# Altium schematic sheet receiver 2.SchDoc
size A4; SheetNumber: 4; SheetTotal: 9
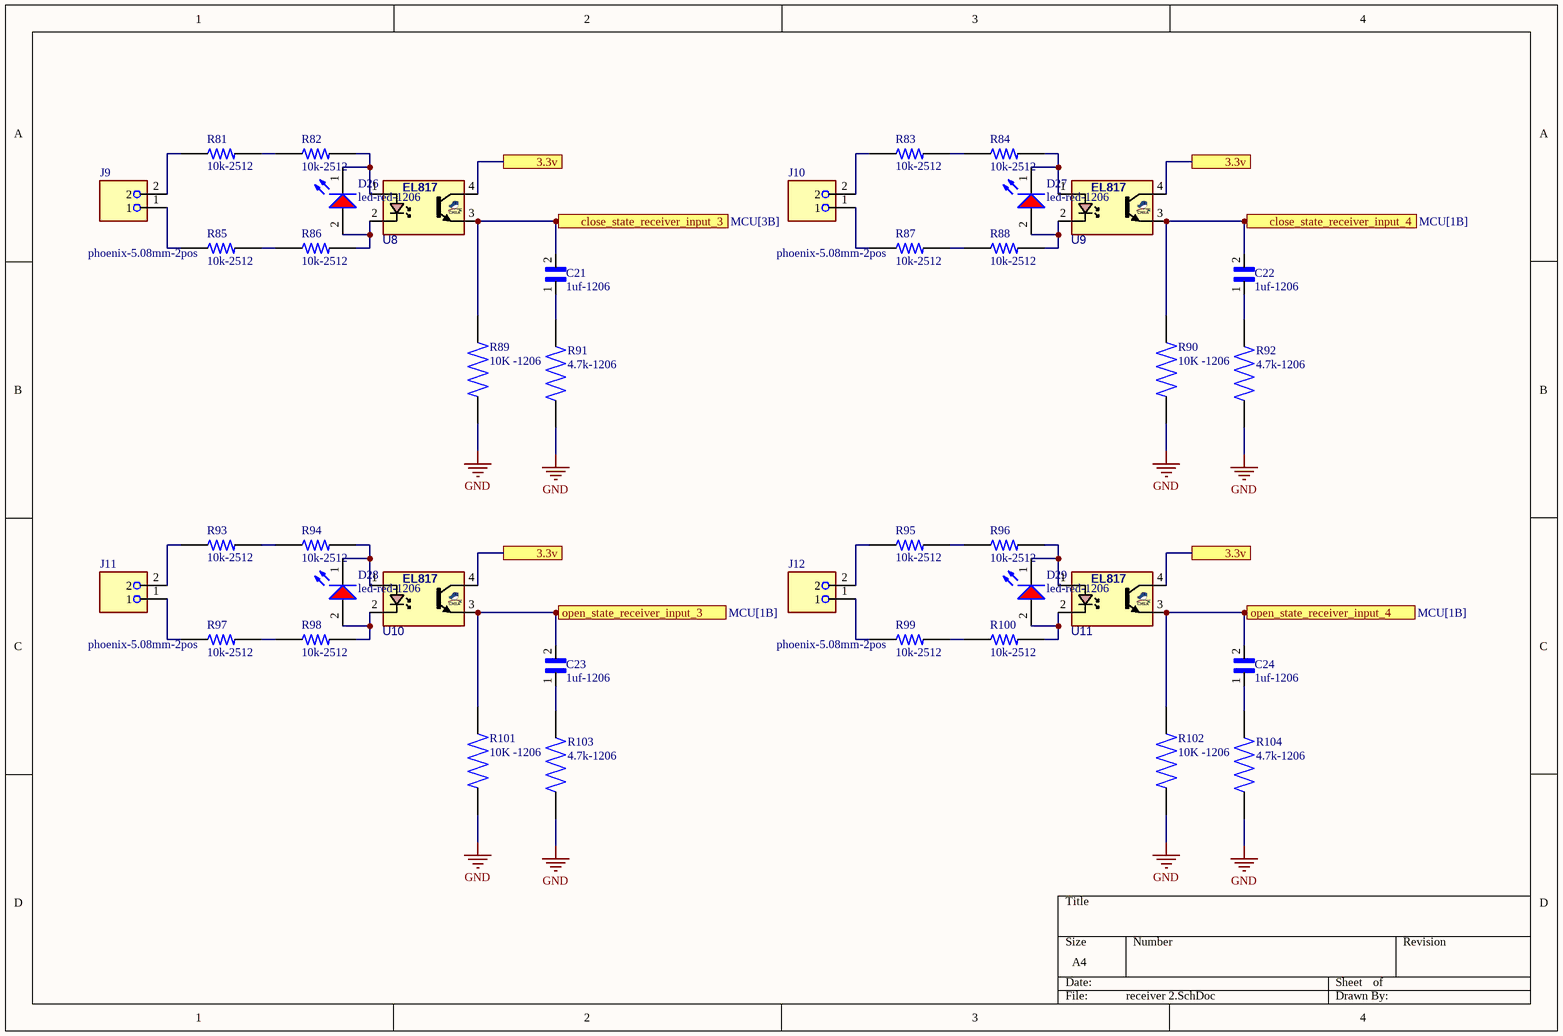
[diagram p0: receiver 2.SchDoc]

## Parts
C21  1uf-1206  [CAPC3216X180N]
C22  1uf-1206  [CAPC3216X180N]
C23  1uf-1206  [CAPC3216X180N]
C24  1uf-1206  [CAPC3216X180N]
D26  led-red-1206  [WL-SMRW_1206 dome_normal use]
D27  led-red-1206  [WL-SMRW_1206 dome_normal use]
D28  led-red-1206  [WL-SMRW_1206 dome_normal use]
D29  led-red-1206  [WL-SMRW_1206 dome_normal use]
J9  phoenix-5.08mm-2pos  [PHOENIX_1715721]
J10  phoenix-5.08mm-2pos  [PHOENIX_1715721]
J11  phoenix-5.08mm-2pos  [PHOENIX_1715721]
J12  phoenix-5.08mm-2pos  [PHOENIX_1715721]
R81  10k-2512  [RESC6331X70N]
R82  10k-2512  [RESC6331X70N]
R83  10k-2512  [RESC6331X70N]
R84  10k-2512  [RESC6331X70N]
R85  10k-2512  [RESC6331X70N]
R86  10k-2512  [RESC6331X70N]
R87  10k-2512  [RESC6331X70N]
R88  10k-2512  [RESC6331X70N]
R89  10K -1206  [RESC3015X65N]
R90  10K -1206  [RESC3015X65N]
R91  4.7k-1206  [RESC3015X65N]
R92  4.7k-1206  [RESC3015X65N]
R93  10k-2512  [RESC6331X70N]
R94  10k-2512  [RESC6331X70N]
R95  10k-2512  [RESC6331X70N]
R96  10k-2512  [RESC6331X70N]
R97  10k-2512  [RESC6331X70N]
R98  10k-2512  [RESC6331X70N]
R99  10k-2512  [RESC6331X70N]
R100  10k-2512  [RESC6331X70N]
R101  10K -1206  [RESC3015X65N]
R102  10K -1206  [RESC3015X65N]
R103  4.7k-1206  [RESC3015X65N]
R104  4.7k-1206  [RESC3015X65N]
U8  EL817  [DIP_4SMD]  (value not drawn)
U9  EL817  [DIP_4SMD]  (value not drawn)
U10  EL817  [DIP_4SMD]  (value not drawn)
U11  EL817  [DIP_4SMD]  (value not drawn)

## Ports
3.3v (see interface[1D], interface[2D], interface[3C], jack driver 1[2A], jack driver 1[3B], jack driver 2[2A], jack driver 2[3B], motor driver 1[2B], motor driver 1[3B], motor driver 2[2B], motor driver 2[3B], Power[2D], receiver 1[2A], receiver 1[2C], receiver 1[4A], receiver 1[4C], receiver 2[2A], receiver 2[2C], receiver 2[4A]), 3.3v (see interface[1D], interface[2D], interface[3C], jack driver 1[2A], jack driver 1[3B], jack driver 2[2A], jack driver 2[3B], motor driver 1[2B], motor driver 1[3B], motor driver 2[2B], motor driver 2[3B], Power[2D], receiver 1[2A], receiver 1[2C], receiver 1[4A], receiver 1[4C], receiver 2[2A], receiver 2[2C], receiver 2[4C]), 3.3v (see interface[1D], interface[2D], interface[3C], jack driver 1[2A], jack driver 1[3B], jack driver 2[2A], jack driver 2[3B], motor driver 1[2B], motor driver 1[3B], motor driver 2[2B], motor driver 2[3B], Power[2D], receiver 1[2A], receiver 1[2C], receiver 1[4A], receiver 1[4C], receiver 2[2A], receiver 2[4A], receiver 2[4C]), 3.3v (see interface[1D], interface[2D], interface[3C], jack driver 1[2A], jack driver 1[3B], jack driver 2[2A], jack driver 2[3B], motor driver 1[2B], motor driver 1[3B], motor driver 2[2B], motor driver 2[3B], Power[2D], receiver 1[2A], receiver 1[2C], receiver 1[4A], receiver 1[4C], receiver 2[2C], receiver 2[4A], receiver 2[4C]), close_state_receiver_input_3 (see MCU[3B]), close_state_receiver_input_4 (see MCU[1B]), open_state_receiver_input_3 (see MCU[1B]), open_state_receiver_input_4 (see MCU[1B])

## Nets
GND: R89.1 R90.1 R91.1 R92.1 R101.1 R102.1 R103.1 R104.1
3.3v: U8.4(C) U9.4(C) U10.4(C) U11.4(C) ; port 3.3v
close_state_receiver_input_3: C21.2 R89.2 U8.3(E) ; port close_state_receiver_input_3
close_state_receiver_input_4: C22.2 R90.2 U9.3(E) ; port close_state_receiver_input_4
open_state_receiver_input_3: C23.2 R101.2 U10.3(E) ; port open_state_receiver_input_3
open_state_receiver_input_4: C24.2 R102.2 U11.3(E) ; port open_state_receiver_input_4
NetC21_1: C21.1 R91.2
NetC22_1: C22.1 R92.2
NetC23_1: C23.1 R103.2
NetC24_1: C24.1 R104.2
NetD26_1: D26.1(K) R82.2 U8.1(A)
NetD26_2: D26.2(A) R86.2 U8.2(K)
NetD27_1: D27.1(K) R84.2 U9.1(A)
NetD27_2: D27.2(A) R88.2 U9.2(K)
NetD28_1: D28.1(K) R94.2 U10.1(A)
NetD28_2: D28.2(A) R98.2 U10.2(K)
NetD29_1: D29.1(K) R96.2 U11.1(A)
NetD29_2: D29.2(A) R100.2 U11.2(K)
NetJ9_1: J9.1 R85.1
NetJ9_2: J9.2 R81.1
NetJ10_1: J10.1 R87.1
NetJ10_2: J10.2 R83.1
NetJ11_1: J11.1 R97.1
NetJ11_2: J11.2 R93.1
NetJ12_1: J12.1 R99.1
NetJ12_2: J12.2 R95.1
NetR81_2: R81.2 R82.1
NetR83_2: R83.2 R84.1
NetR85_2: R85.2 R86.1
NetR87_2: R87.2 R88.1
NetR93_2: R93.2 R94.1
NetR95_2: R95.2 R96.1
NetR97_2: R97.2 R98.1
NetR99_2: R99.2 R100.1

## Library data of the parts
C21-C24 = CGA5L3X8R1H105M160AB: 1ÂµF Â±20% 50V Ceramic Capacitor X8R 1206 (3216 Metric); MF: TDK; Value: *; Purchase-URL: https://pricing.snapeda.com/search/part/CGA5L3X8R1H105M160AB/?ref=eda; Package: 3216 TDK; Availability: In Stock; SnapEDA_Link: https://www.snapeda.com/parts/CGA5L3X8R1H105M160AB/TDK/view-part/?ref=snap; MP: CGA5L3X8R1H105M160AB; Check_prices: https://www.snapeda.com/parts/CGA5L3X8R1H105M160AB/TDK/view-part/?ref=eda; Price: None
D26-D29 = 156120RS82500: WL-SMRW Mono-color Reverse mount Waterclear, SMT, size 1206 dome, Red, 2V, 20°; Manufacturer: Wurth Elektronik; Chip Technology: AlInGaP; Dominant Wavelength: 624nm; Luminous Intensity: 1100mcd; Peak Wavelength: 632nm; Manufacturer Part Number: 156120RS82500; Category: Signal LEDs; Match Code: WL-SMRW; ComponentLink1Description: Website Link; ComponentLink1URL: https://www.we-online.com/redexpert/article/156120RS82500?ad; ComponentLink2Description: Datasheet Link; ComponentLink2URL: https://www.we-online.com/redexpert/spec/156120RS82500?ad; Mount: Surface Mount; Operating Temperature Max: 85°C; Operating Temperature Min: -40°C; Packaging: Tape and Reel; Case/Size Code: 1206 dome; Length: 3.2mm; Width: 1.6mm; Height: 1.85mm; Emitting Color: Red; Forward Voltage: 2V; Viewing Angle: 20°
J9-J12 = 1715721: Package: None; Price: None; Value: *; MP: 1715721; Availability: Unavailable
R81-R88 R93-R100 = 5-2176246-2: 18 kOhms Â±5% 1.5W Chip Resistor 2512 (6432 Metric) Pulse Withstanding Thick Film; MF: TE Connectivity; SnapEDA_Link: https://www.snapeda.com/parts/5-2176246-2/TE+Connectivity+AMP+Connectors/view-part/?ref=snap; Package: None; Value: *; MP: 5-2176246-2; Check_prices: https://www.snapeda.com/parts/5-2176246-2/TE+Connectivity+AMP+Connectors/view-part/?ref=eda
R89-R92 R101-R104 = CPF1206B10KE1: Res Thin Film 1206 10K Ohm 0.1% 1/8W Â±25ppm/Â°C Molded SMD SMD Paper T/R; Power_Rating: .125 W; MF: TE Connectivity; Voltage_Rating: 150 V; Tolerance: .1%; SnapEDA_Link: https://www.snapeda.com/parts/CPF1206B10KE1/TE+Connectivity/view-part/?ref=snap; Package: 1206; Resistance: 10K; Value: *; MP: CPF1206B10KE1; EU_RoHS_Compliance: Compliant; Check_prices: https://www.snapeda.com/parts/CPF1206B10KE1/TE+Connectivity/view-part/?ref=eda
U8-U11 = OPTC_TR4P_EL817_SMD: OPTOCOUPLER, TRANSISTOR, 4PIN; PARAM: IF=5mA; PARAM2: VCE = 5V; PRICE: 300t@Paya; VALUE: EL817; PACKAGE: DIP-4SMD